# EasyEDA Pro project Interconnect Board.epro

# Schematic Schematic4
Board Name: Middle Board; Create Date: 2025-08-10; Page Name: P1; Project Name: GCSE LAMP PCBs; Schematic Name: Schematic4; Update Date: 2025-08-10; Company: EasyEDA.com; Page Size: A4; Version: V1.0
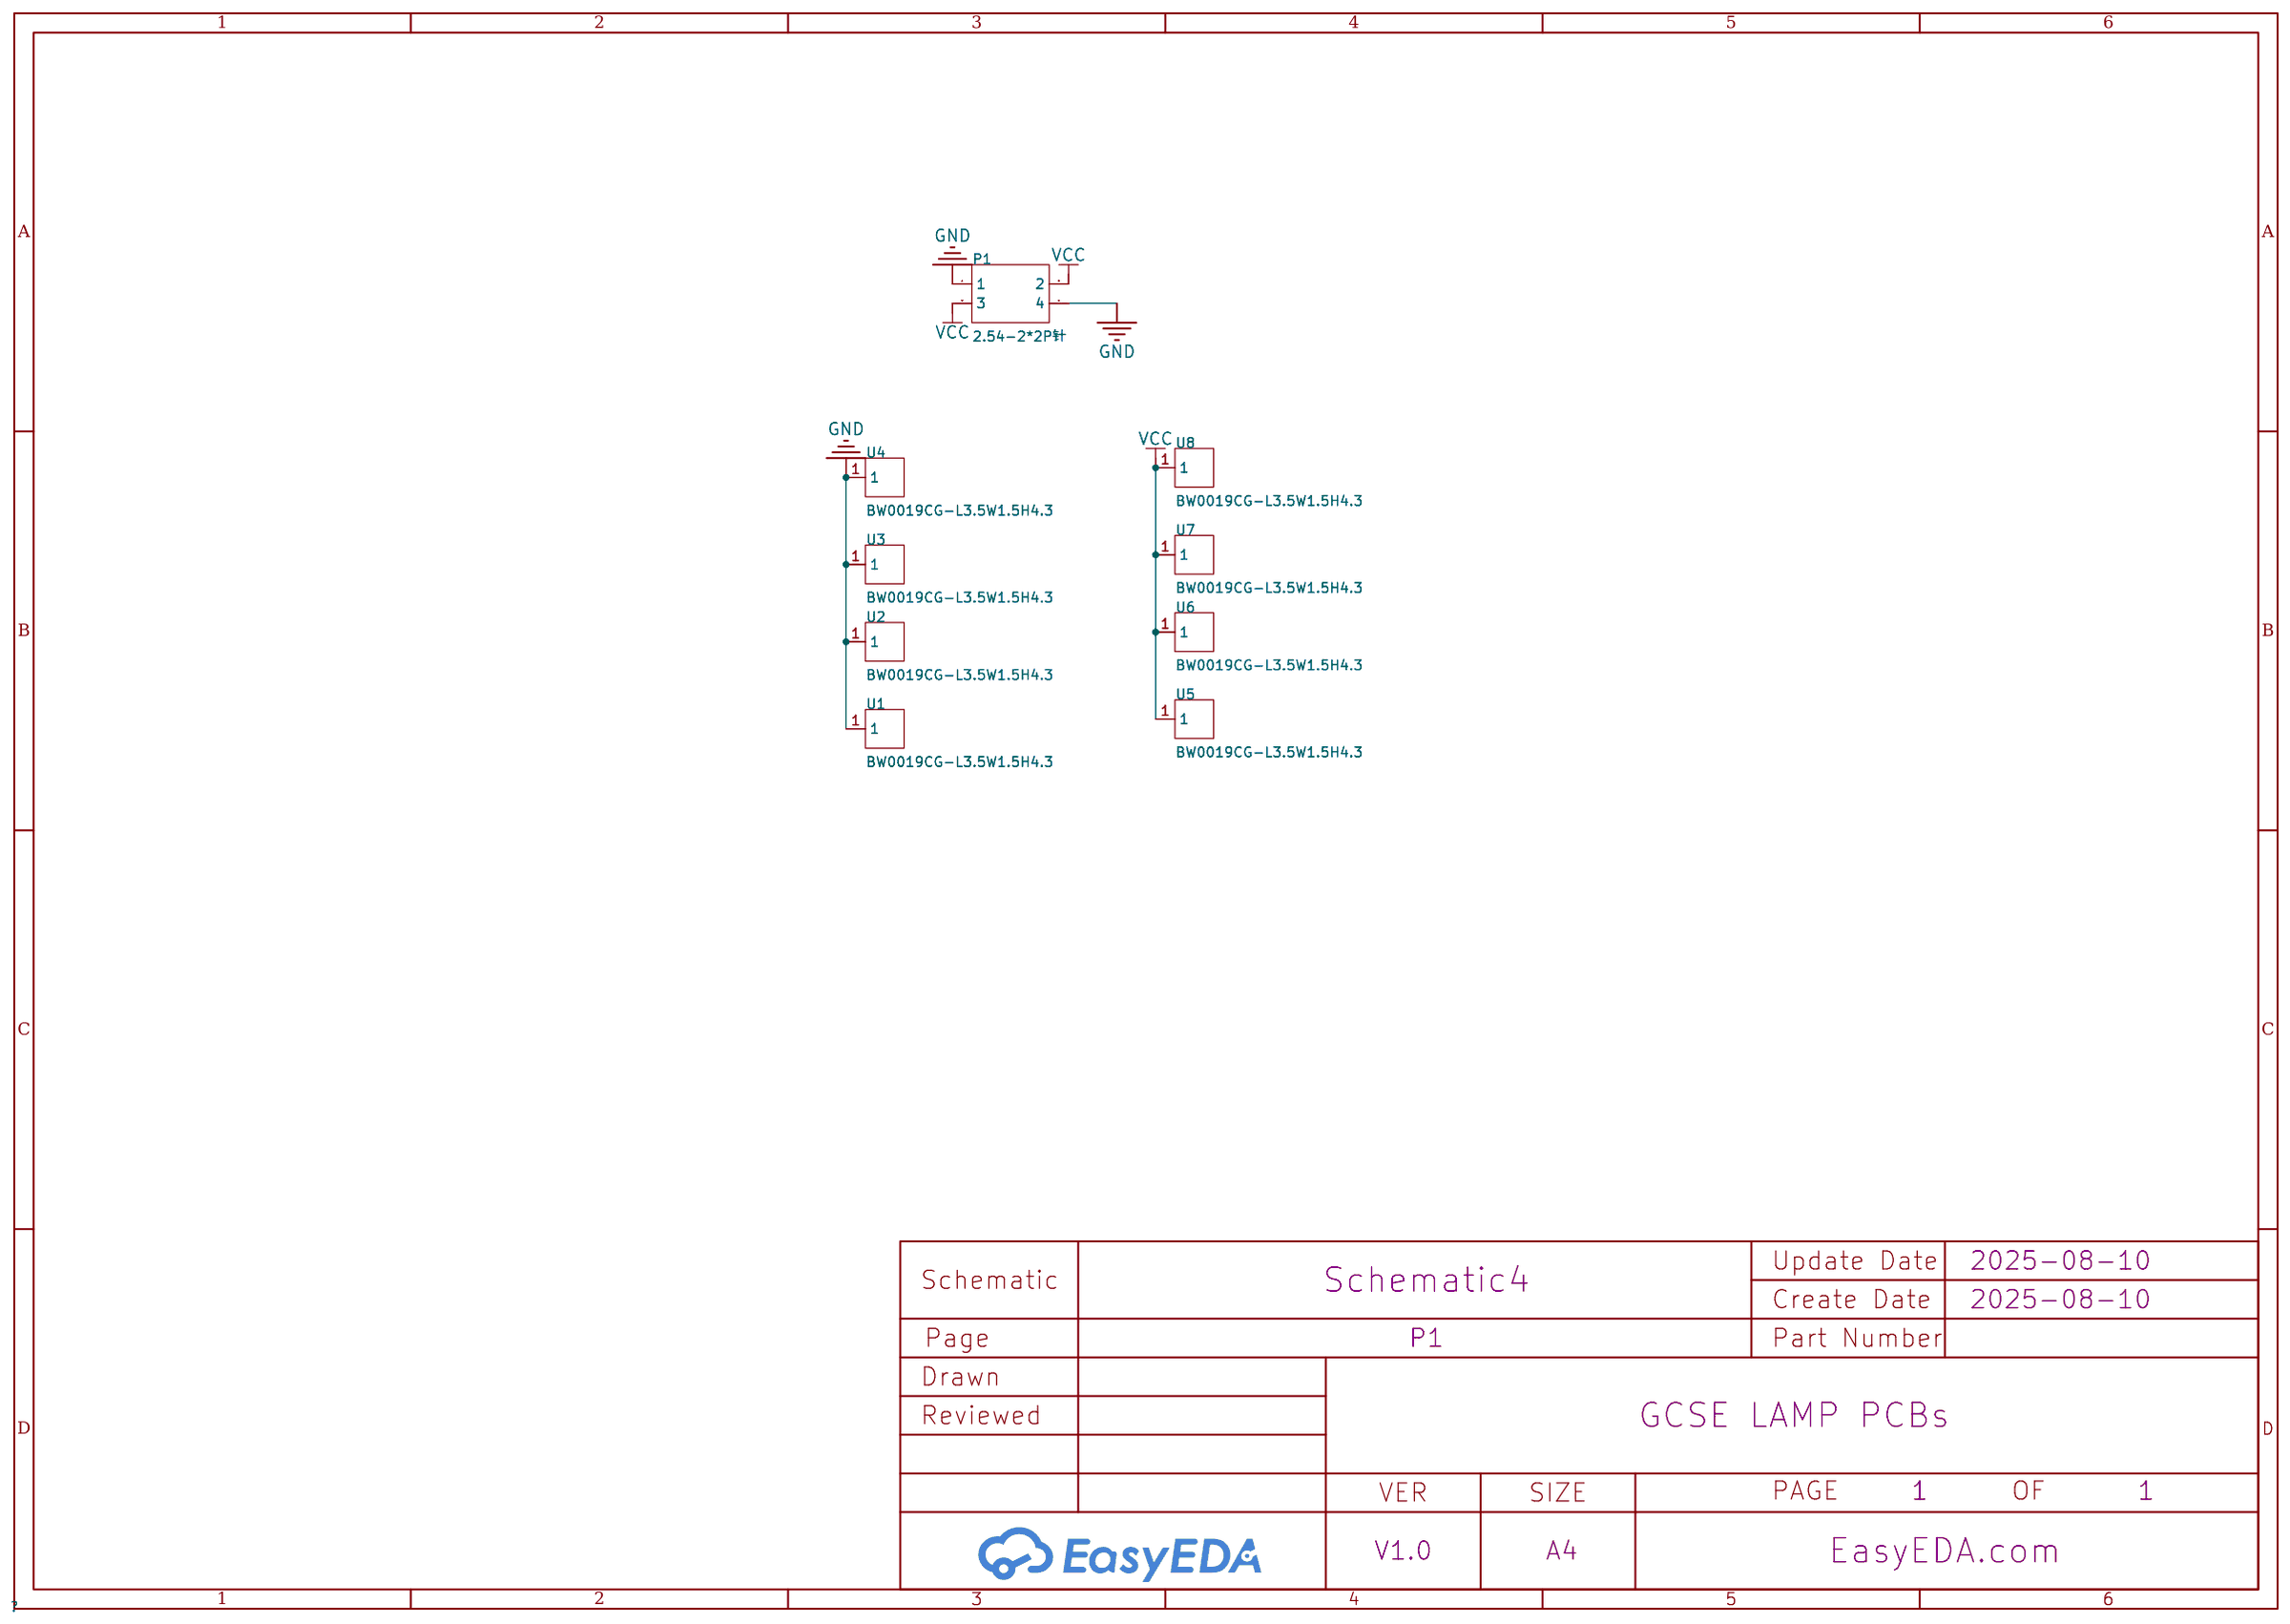
[diagram p0: schematic sheet]

## Parts
P1  2.54-2*2P针  [HDR-TH_4P-P2.54-V-M-R2-C2-S2.54-1]
U1  BW0019CG-L3.5W1.5H4.3  [ANT-SMD_L3.5-W1.5]
U2  BW0019CG-L3.5W1.5H4.3  [ANT-SMD_L3.5-W1.5]
U3  BW0019CG-L3.5W1.5H4.3  [ANT-SMD_L3.5-W1.5]
U4  BW0019CG-L3.5W1.5H4.3  [ANT-SMD_L3.5-W1.5]
U5  BW0019CG-L3.5W1.5H4.3  [ANT-SMD_L3.5-W1.5]
U6  BW0019CG-L3.5W1.5H4.3  [ANT-SMD_L3.5-W1.5]
U7  BW0019CG-L3.5W1.5H4.3  [ANT-SMD_L3.5-W1.5]
U8  BW0019CG-L3.5W1.5H4.3  [ANT-SMD_L3.5-W1.5]

## Library data of the parts
P1 = 2.54-2*2P针: Pin Structure:- Pitch:2.54mm Row Spacing:2.54mm Circluar Pins/Square Pins:- Mounting Type:Through Hole Number of Rows:2 Number of Pins:4P Current Rating:- Voltage Rating (Max):- Length of Mating Pin:- Insulation Height:- Contact Material:- Contact Plating; LCSC Part Name: 间距:2.54mm 直插; Supplier Part: C66690; Manufacturer: BOOMELE(博穆精密); Supplier Footprint: 插件,P=2.54mm; JLCPCB Part Class: Extended Part; Datasheet: https://atta.szlcsc.com/upload/public/pdf/source/20221201/C605E3BE9C0F7226363017EFD1BDE852.pdf; Supplier: LCSC; Pitch: 2.54mm; Row Spacing: 2.54mm; Mounting Type: Through Hole; Number of Rows: 2; Number of Pins: 4P; Color: Black
U1-U8 = BW0019CG-L3.5W1.5H4.3: LCSC Part Name: BAT WIRELESS(蝙蝠无线) 天线弹片 3.5mmx1.5mmx4.3mm 301不锈钢 圆盘; Supplier Part: C2826517; Manufacturer: BAT WIRELESS(蝙蝠无线); JLCPCB Part Class: Extended Part; Datasheet: https://atta.szlcsc.com/upload/public/pdf/source/20210416/C2826517_0912283413194E711A224BF242A74BD3.pdf; Supplier: LCSC

## Nets
GND: P1.1 P1.4 U1.1 U2.1 U3.1 U4.1
VCC: P1.2 P1.3 U5.1 U6.1 U7.1 U8.1

# Board PCB7
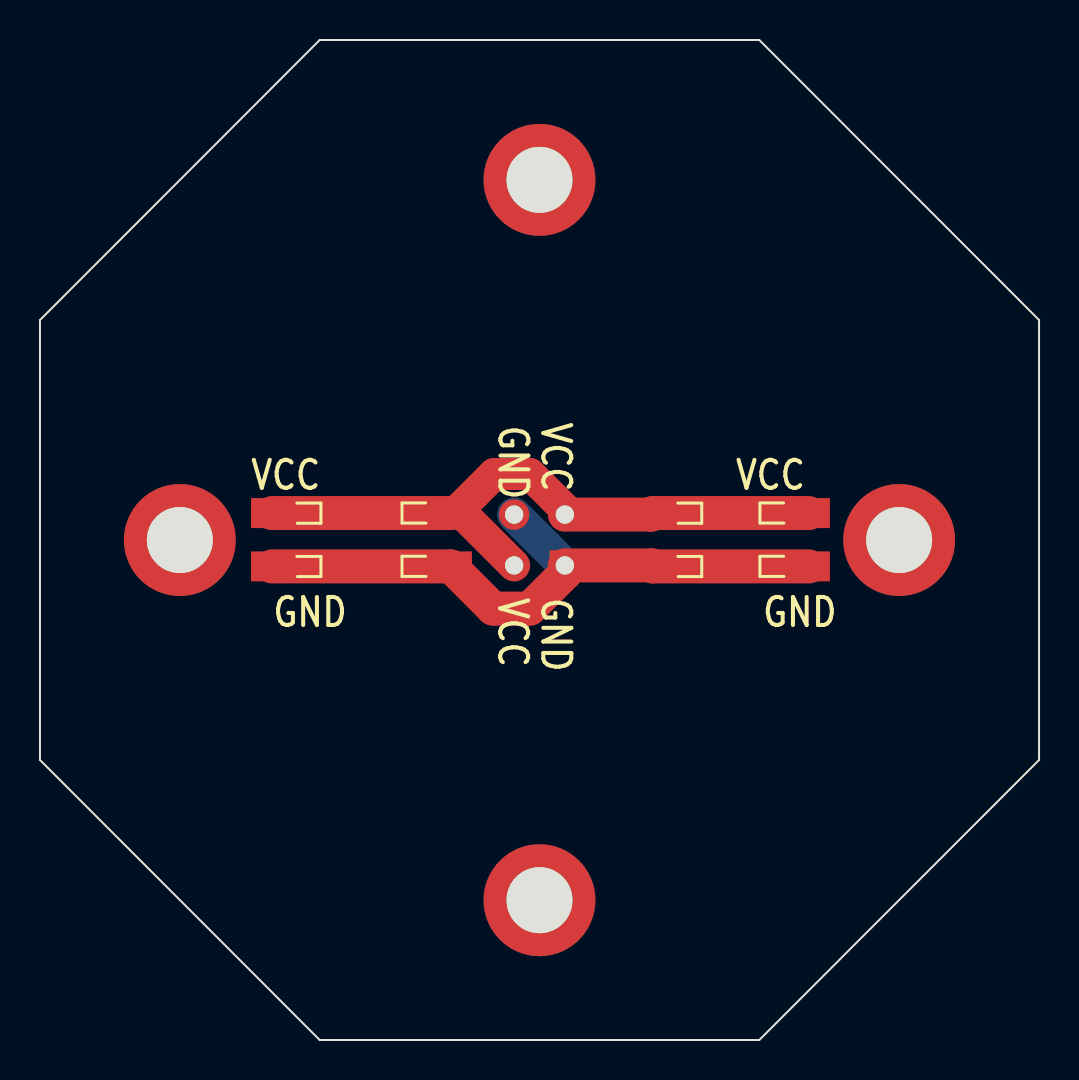
[diagram p1: board, top side]
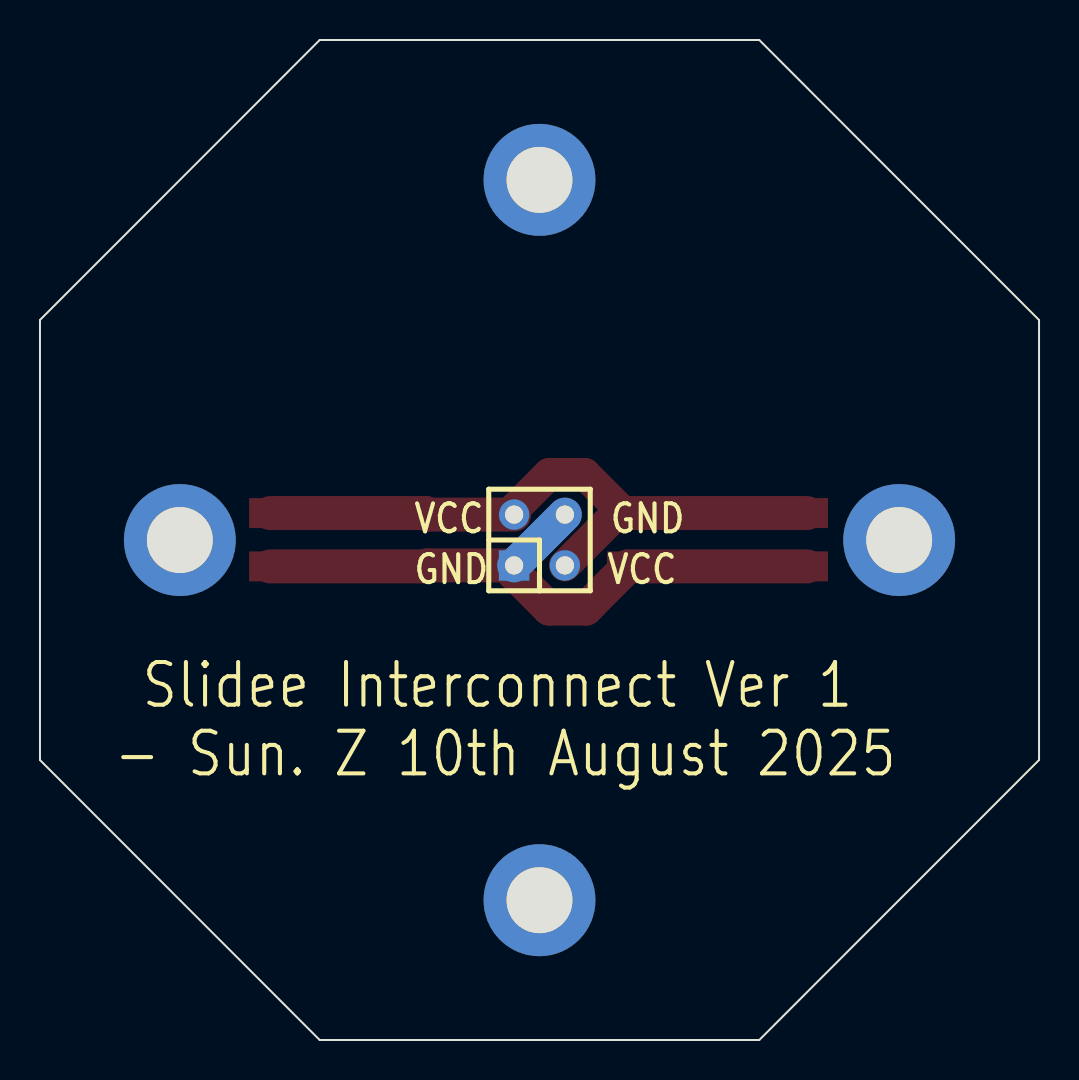
[diagram p2: board, bottom side, seen from below]

Outline 50 x 50 mm; copper layers: Top Layer, Bottom Layer. Coordinates in mm from the lower left corner of the outline.
Outline path: 0,36 14,50 36,50 50,36 50,14 36,0 14,0 0,14 0,36
Stack: Top Layer 0.035mm / Dielectric1 1.51mm FR4 er 4.5 / Bottom Layer 0.035mm

## Design rules (mm)
template: JLCPCB Capability(Two Layers Board)
spacing copperThickness1oz (default): track to track 0.102, other pairs 0.152 to 0.3
spacing copperThickness2oz: track to track 0.203, other pairs 0.152 to 0.3
track width copperThickness1oz (default): min 0.127, default 0.254, max 2.54
track width copperThickness2oz: min 0.203, default 0.254, max 2.54
differential pair differentialPair (default): width min 0.127, default 0.254, max 2.54; gap min 0.152, default 0.152
via viaSize (default): diameter min 0.5, default 0.61, max 10; hole min 0.3, default 0.305, max 6.3

## Placement (name value [footprint] x y rotation side)
NOREF  -  [Pad_e97]  43 25 0 top
NOREF#2  -  [Pad_e98]  25 6.99 0 top
NOREF#3  -  [Pad_e101]  25 43.01 0 top
NOREF#4  -  [Pad_e100]  7 25 0 top
P1  2.54-2*2P针  [HDR-TH_4P-P2.54-V-M-R2-C2-S2.54-1]  25 25 180 bottom
U1  BW0019CG-L3.5W1.5H4.3  [ANT-SMD_L3.5-W1.5]  38.48 23.68 0 top
U2  BW0019CG-L3.5W1.5H4.3  [ANT-SMD_L3.5-W1.5]  30.67 23.68 180 top
U3  BW0019CG-L3.5W1.5H4.3  [ANT-SMD_L3.5-W1.5]  20.57 23.68 0 top
U4  BW0019CG-L3.5W1.5H4.3  [ANT-SMD_L3.5-W1.5]  11.61 23.68 180 top
U5  BW0019CG-L3.5W1.5H4.3  [ANT-SMD_L3.5-W1.5]  38.48 26.35 0 top
U6  BW0019CG-L3.5W1.5H4.3  [ANT-SMD_L3.5-W1.5]  20.57 26.35 0 top
U7  BW0019CG-L3.5W1.5H4.3  [ANT-SMD_L3.5-W1.5]  30.67 26.35 180 top
U8  BW0019CG-L3.5W1.5H4.3  [ANT-SMD_L3.5-W1.5]  11.61 26.35 180 top

## Footprints (pads in the part's own frame, mm; a bottom-side part is the same pattern mirrored in y, then rotated)
ANT-SMD_L3.5-W1.5
  rect 2.1x1.5 smd: 1(0,0)
HDR-TH_4P-P2.54-V-M-R2-C2-S2.54-1
  rect 1.524x1.524 hole 0.914: 1(-1.27,-1.27)
  round 1.524 hole 0.914: 2(-1.27,1.27) 3(1.27,-1.27) 4(1.27,1.27)
Pad_e97
  round 5.6 hole 3.3: 1(0,0)
Pad_e98
  round 5.6 hole 3.3: 2(0,0)
Pad_e100
  round 5.6 hole 3.3: 4(0,0)
Pad_e101
  round 5.6 hole 3.3: 5(0,0)

## Nets
As in the schematic.

Pads without a net: NOREF 1; NOREF#2 2; NOREF#3 5; NOREF#4 4

## Routing (per net, layer and track width the routed paths; a pad name or vN(x,y) marks a point on that pad's centre or on a via; arc(x,y) is an arc through that point)
GND: length 32.5
  Top Layer w1.7: U1.1 U2.1 30.62,23.73 26.27,23.73 26.27,23.33 24.51,21.57 22.68,21.57 U3.1 U4.1
  Bottom Layer w1.7: P1.4 26.27,23.73
VCC: length 32.6
  Top Layer w1.6: U6.1 21.11,26.35 ; 21.11,26.35 23.73,23.73 ; 21.11,26.35 21.11,26.68 22.73,28.3 24.51,28.3 26.27,26.54 P1.2
  Top Layer w1.7: U5.1 U7.1 30.59,26.27 P1.2 ; U8.1 U6.1

## Text on the board
Bottom Silkscreen Layer: GND | VCC | Slidee Interconnect Ver 1 / - Sun. Z 10th August 2025
Top Silkscreen Layer: VCC | GND
